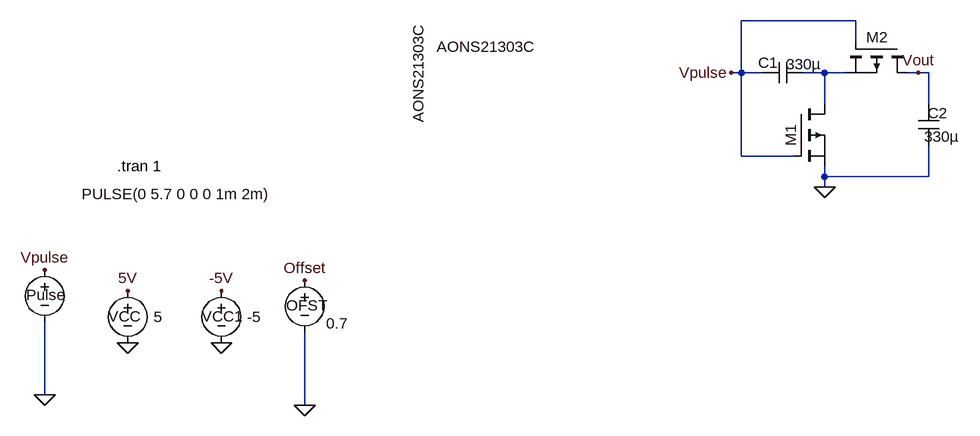
[diagram p0: schematic Negative Voltage Generator.asc]
Negative Voltage Generator.asc, the LTspice schematic file:
Version 4
SHEET 1 2432 680
WIRE 1984 -368 1808 -368
WIRE 1984 -336 1984 -368
WIRE 1808 -288 1808 -368
WIRE 1808 -288 1792 -288
WIRE 1840 -288 1808 -288
WIRE 1936 -288 1904 -288
WIRE 1968 -288 1936 -288
WIRE 2080 -288 2064 -288
WIRE 2096 -288 2080 -288
WIRE 1936 -240 1936 -288
WIRE 2096 -240 2096 -288
WIRE 1808 -160 1808 -288
WIRE 1888 -160 1808 -160
WIRE 1936 -128 1936 -144
WIRE 2096 -128 2096 -176
WIRE 2096 -128 1936 -128
WIRE 1936 -112 1936 -128
WIRE 736 208 736 96
WIRE 1136 224 1136 112
FLAG 864 48 5V
FLAG 864 128 0
FLAG 736 208 0
FLAG 736 16 Vpulse
FLAG 1008 128 0
FLAG 1136 224 0
FLAG 1136 32 Offset
FLAG 1008 48 -5V
FLAG 1936 -112 0
FLAG 1792 -288 Vpulse
FLAG 2080 -288 Vout
SYMBOL voltage 736 0 R0
WINDOW 123 0 0 Left 0
WINDOW 39 0 0 Left 0
WINDOW 0 -28 54 Left 2
WINDOW 3 57 -101 Left 2
SYMATTR InstName Pulse
SYMATTR Value PULSE(0 5.7 0 0 0 1m 2m)
SYMBOL voltage 864 32 R0
WINDOW 0 -30 55 Left 2
WINDOW 3 40 56 Left 2
WINDOW 123 0 0 Left 0
WINDOW 39 0 0 Left 0
SYMATTR InstName VCC
SYMATTR Value 5
SYMBOL voltage 1008 32 R0
WINDOW 0 -30 55 Left 2
WINDOW 3 40 56 Left 2
WINDOW 123 0 0 Left 0
WINDOW 39 0 0 Left 0
SYMATTR InstName VCC1
SYMATTR Value -5
SYMBOL voltage 1136 16 R0
WINDOW 123 0 0 Left 0
WINDOW 39 0 0 Left 0
WINDOW 0 -28 54 Left 2
WINDOW 3 33 82 Left 2
SYMATTR InstName OFST
SYMATTR Value 0.7
SYMBOL cap 1904 -304 R90
WINDOW 0 16 55 VBottom 2
WINDOW 3 -13 0 VTop 2
SYMATTR InstName C1
SYMATTR Value 330µ
SYMATTR SpiceLine Rser=1m
SYMBOL cap 2112 -176 R180
WINDOW 0 -13 50 Left 2
WINDOW 3 -31 14 Left 2
SYMATTR InstName C2
SYMATTR Value 330µ
SYMATTR SpiceLine Rser=1m
SYMBOL pmos 2064 -336 R90
WINDOW 0 -7 30 VRight 2
WINDOW 3 -27 753 Left 2
SYMATTR InstName M2
SYMATTR Value AONS21303C
SYMBOL pmos 1888 -240 R0
WINDOW 0 -4 32 VRight 2
WINDOW 3 -549 -88 Left 2
SYMATTR InstName M1
SYMATTR Value AONS21303C
TEXT 848 -144 Left 2 !.tran 1

The netlist it stands for:
* Negative Voltage Generator.asc
V§Pulse Vpulse 0 PULSE(0 5.7 0 0 0 1m 2m)
VCC 5V 0 5
VCC1 -5V 0 -5
V§OFST Offset 0 0.7
C1 N001 Vpulse 330µ Rser=1m
C2 0 Vout 330µ Rser=1m
M2 Vout Vpulse N001 N001 AONS21303C
M1 N001 Vpulse 0 0 AONS21303C
.model NMOS NMOS
.model PMOS PMOS
.lib standard.mos
.tran 1
.backanno
.end